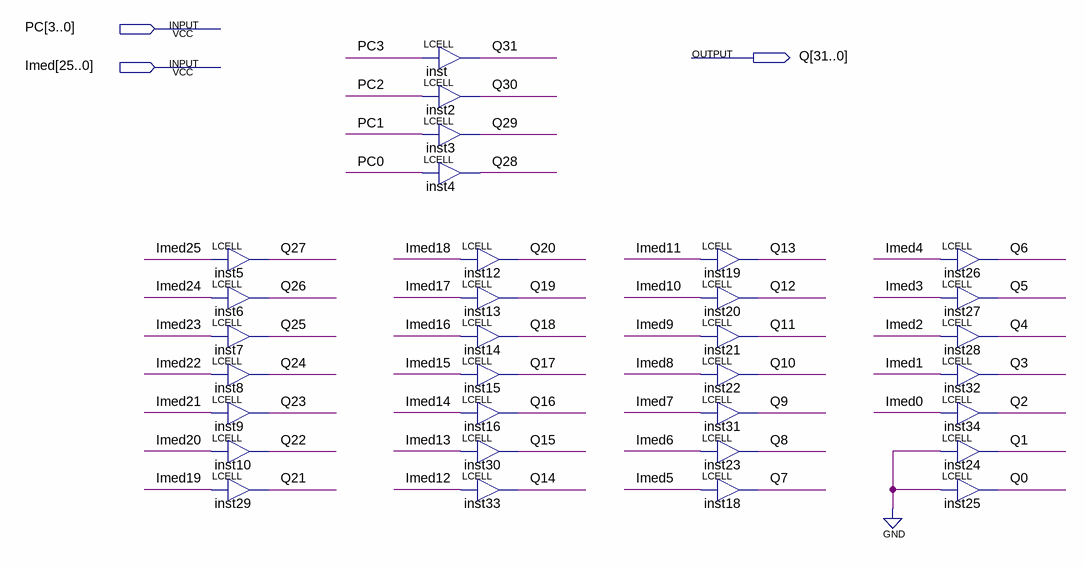
[diagram p0: schematic sheet]
// Quartus schematic concat.bdf as structural Verilog: 32 symbols, 3 pins
module concat (
  input  [3:0] PC,
  input  [25:0] Imed,
  output [31:0] Q
);

  LCELL inst5 (.IN(Imed[25]), .OUT(Q[27]));
  LCELL inst6 (.IN(Imed[24]), .OUT(Q[26]));
  LCELL inst7 (.IN(Imed[23]), .OUT(Q[25]));
  LCELL inst8 (.IN(Imed[22]), .OUT(Q[24]));
  LCELL inst9 (.IN(Imed[21]), .OUT(Q[23]));
  LCELL inst10 (.IN(Imed[20]), .OUT(Q[22]));
  LCELL inst29 (.IN(Imed[19]), .OUT(Q[21]));
  LCELL inst (.IN(PC[3]), .OUT(Q[31]));
  LCELL inst2 (.IN(PC[2]), .OUT(Q[30]));
  LCELL inst3 (.IN(PC[1]), .OUT(Q[29]));
  LCELL inst4 (.IN(PC[0]), .OUT(Q[28]));
  LCELL inst12 (.IN(Imed[18]), .OUT(Q[20]));
  LCELL inst13 (.IN(Imed[17]), .OUT(Q[19]));
  LCELL inst14 (.IN(Imed[16]), .OUT(Q[18]));
  LCELL inst15 (.IN(Imed[15]), .OUT(Q[17]));
  LCELL inst16 (.IN(Imed[14]), .OUT(Q[16]));
  LCELL inst30 (.IN(Imed[13]), .OUT(Q[15]));
  LCELL inst33 (.IN(Imed[12]), .OUT(Q[14]));
  LCELL inst19 (.IN(Imed[11]), .OUT(Q[13]));
  LCELL inst20 (.IN(Imed[10]), .OUT(Q[12]));
  LCELL inst21 (.IN(Imed[9]), .OUT(Q[11]));
  LCELL inst22 (.IN(Imed[8]), .OUT(Q[10]));
  LCELL inst31 (.IN(Imed[7]), .OUT(Q[9]));
  LCELL inst23 (.IN(Imed[6]), .OUT(Q[8]));
  LCELL inst18 (.IN(Imed[5]), .OUT(Q[7]));
  LCELL inst26 (.IN(Imed[4]), .OUT(Q[6]));
  LCELL inst27 (.IN(Imed[3]), .OUT(Q[5]));
  LCELL inst28 (.IN(Imed[2]), .OUT(Q[4]));
  LCELL inst32 (.IN(Imed[1]), .OUT(Q[3]));
  LCELL inst34 (.IN(Imed[0]), .OUT(Q[2]));
  LCELL inst24 (.IN(1'b0), .OUT(Q[1]));
  LCELL inst25 (.IN(1'b0), .OUT(Q[0]));
endmodule
